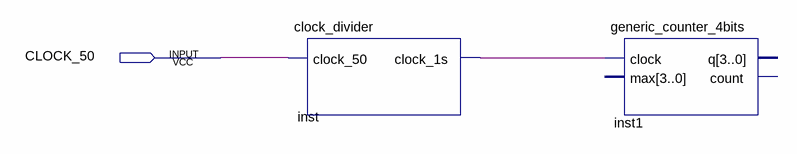
[diagram p0: schematic sheet]
// Quartus schematic testbench.bdf as structural Verilog: 2 symbols, 1 pins
module testbench (
  input  CLOCK_50
);

  wire inst_clock_1s;

  clock_divider inst (.clock_50(CLOCK_50), .clock_1s(inst_clock_1s));
  generic_counter_4bits inst1 (.clock(inst_clock_1s));  // open: max, q, count
endmodule
